# EAGLE design Impedance analyzer (EAGLE 8.7.1)
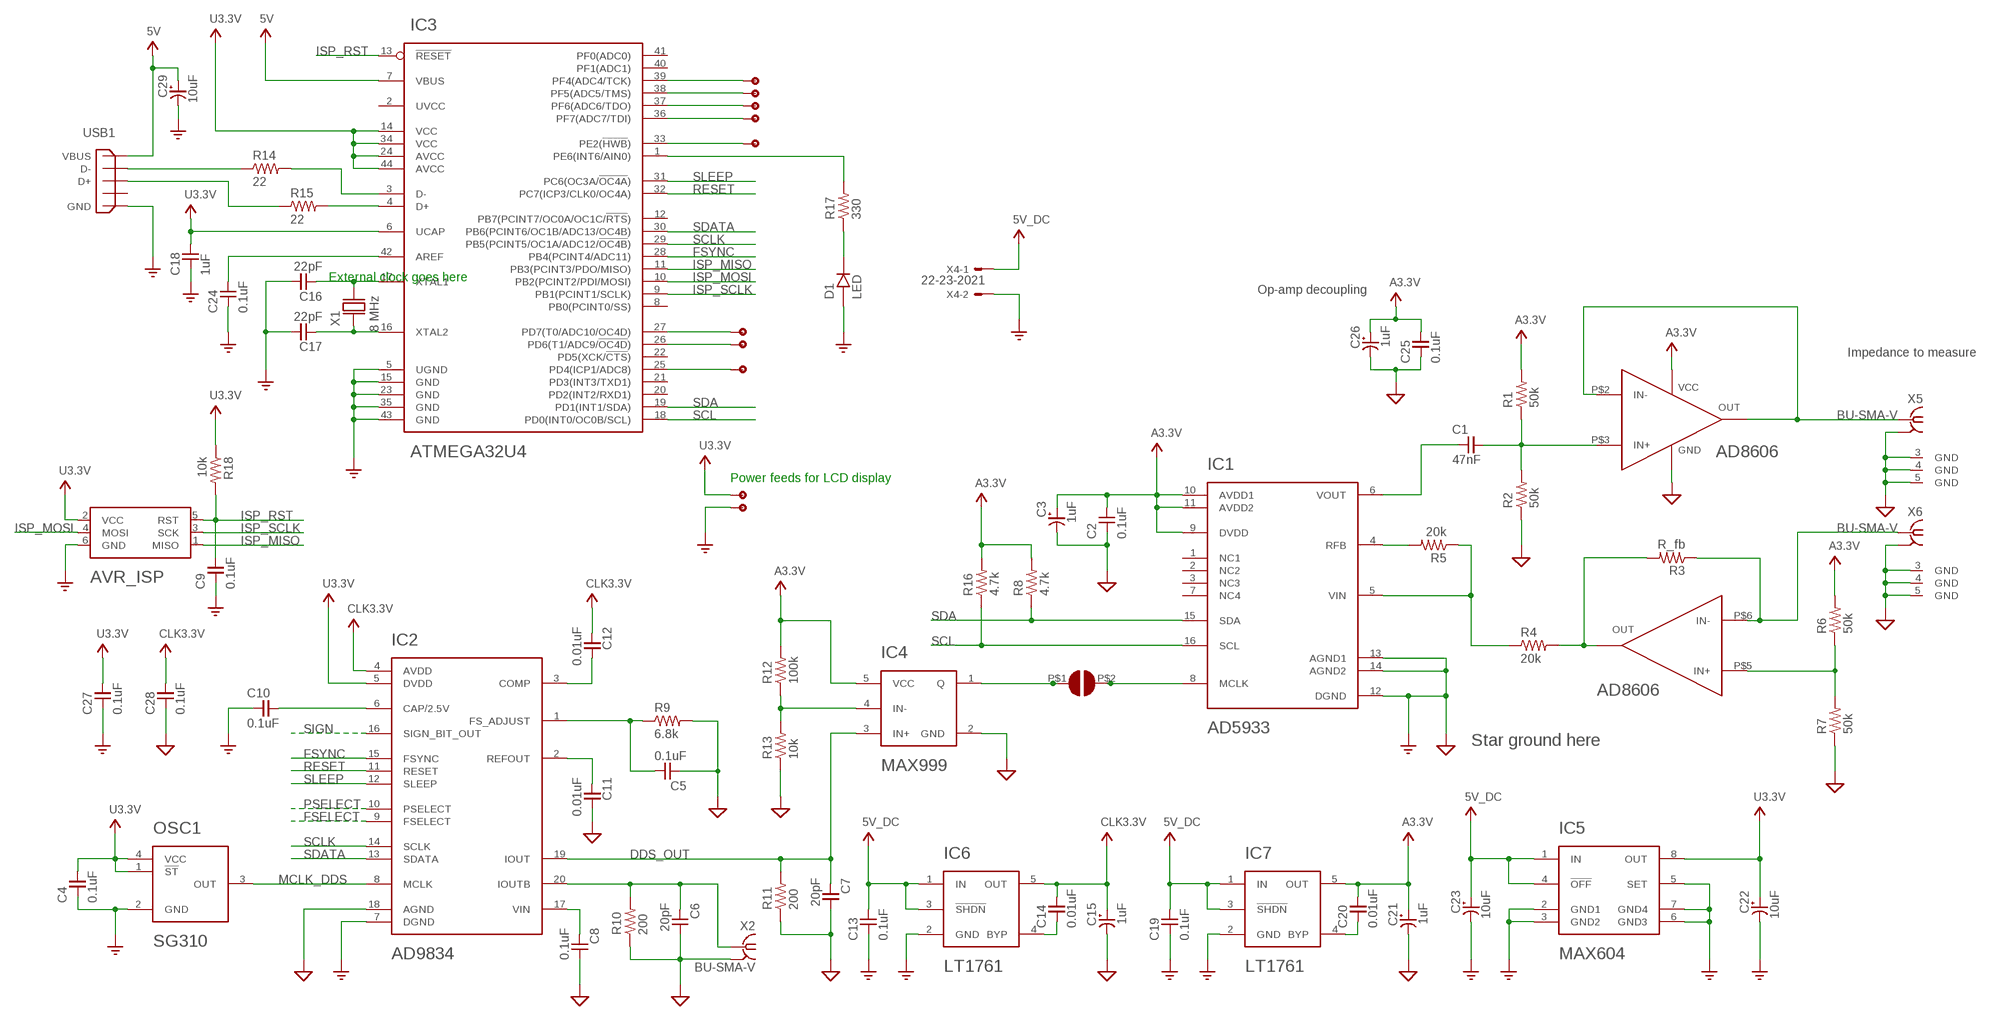
[diagram p0: schematic, sheet 1]

## Parts
C1  47nF  CAPACITOR0805  [0805]
C2  0.1uF  CAPACITOR0805  [0805]
C3  1uF  CAPACITOR+  [1206]
C4  0.1uF  CAPACITOR0805  [0805]
C5  0.1uF  CAPACITOR0805  [0805]
C6  20pF  CAPACITOR0805  [0805]
C7  20pF  CAPACITOR0805  [0805]
C8  0.1uF  CAPACITOR0805  [0805]
C9  0.1uF  CAPACITOR0805  [0805]
C10  0.1uF  CAPACITOR0805  [0805]
C11  0.01uF  CAPACITOR0805  [0805]
C12  0.01uF  CAPACITOR0805  [0805]
C13  0.1uF  CAPACITOR0805  [0805]
C14  0.01uF  CAPACITOR0805  [0805]
C15  1uF  CAPACITOR+  [1206]
C16  22pF  CAPACITOR0805  [0805]
C17  22pF  CAPACITOR0805  [0805]
C18  1uF  CAPACITOR0805  [0805]
C19  0.1uF  CAPACITOR0805  [0805]
C20  0.01uF  CAPACITOR0805  [0805]
C21  1uF  CAPACITOR+  [1206]
C22  10uF  CAPACITOR+  [1206]
C23  10uF  CAPACITOR+  [1206]
C24  0.1uF  CAPACITOR0805  [0805]
C25  0.1uF  CAPACITOR0805  [0805]
C26  1uF  CAPACITOR+  [1206]
C27  0.1uF  CAPACITOR0805  [0805]
C28  0.1uF  CAPACITOR0805  [0805]
C29  10uF  CAPACITOR+  [1206]
D1  LED  DIODE0805  [0805]
IC1  AD5933  [SSOP_16]
IC2  AD9834  [TSSOP_20]
IC3  ATMEGA32U4  [TQFP_44]
IC4  MAX999  [SOT_23-5]
IC5  MAX604  MAX603  [SO_8]
IC6  LT1761  [TSOT-23]
IC7  LT1761  [TSOT-23]
IC8  AD8606  [MSOP_8]
OSC1  SG310  [SG310]
R1  50k  RESISTORSMD0805  [0805]
R2  50k  RESISTORSMD0805  [0805]
R3  R_fb  RESISTORSMD0805  [0805]
R4  20k  RESISTORSMD0805  [0805]
R5  20k  RESISTORSMD0805  [0805]
R6  50k  RESISTORSMD0805  [0805]
R7  50k  RESISTORSMD0805  [0805]
R8  4.7k  RESISTORSMD0805  [0805]
R9  6.8k  RESISTORSMD0805  [0805]
R10  200  RESISTORSMD0805  [0805]
R11  200  RESISTORSMD0805  [0805]
R12  100k  RESISTORSMD0805  [0805]
R13  10k  RESISTORSMD0805  [0805]
R14  22  RESISTORSMD0805  [0805]
R15  22  RESISTORSMD0805  [0805]
R16  4.7k  RESISTORSMD0805  [0805]
R17  330  RESISTORSMD0805  [0805]
R18  10k  RESISTORSMD0805  [0805]
TP1  TPSMALL  [TP_SMALL]
TP2  TPSMALL  [TP_SMALL]
TP3  TPSMALL  [TP_SMALL]
TP4  TPSMALL  [TP_SMALL]
TP5  TPSMALL  [TP_SMALL]
TP6  TPSMALL  [TP_SMALL]
TP7  TPSMALL  [TP_SMALL]
TP10  TPSMALL  [TP_SMALL]
TP11  TPSMALL  [TP_SMALL]
TP12  TPSMALL  [TP_SMALL]
U$41  ISP_HEADER  [ISP_HEADER]
U$57  JUMPER  [JUMPER]
USB1  USB_MINIUX60-MB-5ST  [USB_MINI]
X1  8 MHz  CRYSTALNX5032  [NX5032]
X2  BU-SMA-V  [BU-SMA-V]
X4  22-23-2021  [22-23-2021]
X5  BU-SMA-V  [BU-SMA-V]
X6  BU-SMA-V  [BU-SMA-V]

## Nets
5V_DC: C13.2 C19.2 C23.1 IC5.1(IN) IC5.4(!OFF) IC6.1(IN) IC6.3(!SHDN) IC7.1(IN) IC7.3(!SHDN) X4.1
5V_USB: C29.1 IC3.7(VBUS) USB1.1(VBUS) ; supply symbol labelled 5V
A3V3: C2.2 C3.1 C20.2 C21.1 C25.2 C26.1 IC1.9(DVDD) IC1.10(AVDD1) IC1.11(AVDD2) IC4.5(VCC) IC7.5(OUT) IC8.P$8(VCC) R1.2 R6.2 R8.2 R12.2 R16.2 ; supply symbol labelled A3.3V
CLK3V3: C12.1 C14.2 C15.1 C28.2 IC2.4(AVDD) IC6.5(OUT) ; supply symbol labelled CLK3.3V
DDS_OUT: C7.1 IC2.19(IOUT) IC4.3(IN+) R11.2
FSELECT: IC2.9(FSELECT)
FSYNC: IC2.15(FSYNC) IC3.28(PB4(PCINT4/ADC11))
GND: C2.1 C3.2 C4.1 C5.1 C6.2 C7.2 C8.2 C9.1 C10.1 C11.2 C13.1 C15.2 C16.2 C17.2 C18.1 C19.1 C21.2 C22.2 C23.2 C24.1 C25.1 C26.2 C27.1 C28.1 C29.2 D1.1(A) IC1.12(DGND) IC1.13(AGND1) IC1.14(AGND2) IC2.7(DGND) IC2.18(AGND) IC3.5(UGND) IC3.15(GND) IC3.23(GND) IC3.35(GND) IC3.43(GND) IC4.2(GND) IC5.2(GND1) IC5.3(GND2) IC5.5(SET) IC5.6(GND3) IC5.7(GND4) IC6.2(GND) IC7.2(GND) IC8.P$4(GND) OSC1.2(GND) R2.1 R7.1 R9.2 R10.1 R11.1 R13.1 TP11.TP_SMALL U$41.6(GND) USB1.5(GND) X2.2(GND) X4.2 X5.2(GND) X5.3(GND) X5.4(GND) X5.5(GND) X6.2(GND) X6.3(GND) X6.4(GND) X6.5(GND) ; supply symbol labelled AGND
ISP_MISO: IC3.11(PB3(PCINT3/PDO/MISO)) U$41.1(MISO)
ISP_MOSI: IC3.10(PB2(PCINT2/PDI/MOSI)) U$41.4(MOSI)
ISP_RST: C9.2 IC3.13(!RESET!) R18.2 U$41.5(RST)
ISP_SCLK: IC3.9(PB1(PCINT1/SCLK)) U$41.3(SCK)
MCLK_DDS: IC2.8(MCLK) OSC1.3(OUT)
N$1: C1.2 IC8.P$3(IN+) R1.1 R2.2
N$2: IC8.P$1(OUT) IC8.P$2(IN-) X5.1
N$3: IC8.P$6(IN-) R3.1 X6.1
N$4: IC8.P$7(OUT) R3.2 R4.2
N$5: IC8.P$5(IN+) R6.1 R7.2
N$6: IC1.4(RFB) R5.2
N$7: IC1.5(VIN) R4.1 R5.1
N$8: C1.1 IC1.6(VOUT)
N$9: IC3.1(PE6(INT6/AIN0)) R17.2
N$10: C24.2 IC3.42(AREF)
N$11: C5.2 IC2.1(FS_ADJUST) R9.1
N$12: C6.1 IC2.20(IOUTB) R10.2 X2.1
N$13: C10.2 IC2.6(CAP/2.5V)
N$14: C11.1 IC2.2(REFOUT)
N$15: D1.2(K) R17.1
N$16: C8.1 IC2.17(VIN)
N$17: C12.2 IC2.3(COMP)
N$18: IC3.27(PD7(T0/ADC10/OC4D)) TP1.TP_SMALL
N$19: C14.1 IC6.4(BYP)
N$20: IC3.26(PD6(T1/ADC9/!OC4D!)) TP2.TP_SMALL
N$21: IC3.39(PF4(ADC4/TCK)) TP3.TP_SMALL
N$22: IC4.4(IN-) R12.1 R13.2
N$23: IC3.4(D+) R15.2
N$24: R15.1 USB1.3(D+)
N$25: R14.1 USB1.2(D-)
N$26: IC3.3(D-) R14.2
N$27: C16.1 IC3.17(XTAL1) X1.P$2
N$28: C17.1 IC3.16(XTAL2) X1.P$1
N$29: IC3.38(PF5(ADC5/TMS)) TP4.TP_SMALL
N$30: C20.1 IC7.4(BYP)
N$31: IC3.37(PF6(ADC6/TDO)) TP5.TP_SMALL
N$32: IC3.36(PF7(ADC7/TDI)) TP6.TP_SMALL
N$33: IC3.25(PD4(ICP1/ADC8)) TP7.TP_SMALL
N$36: IC4.1(Q) U$57.P$1
N$37: IC1.8(MCLK) U$57.P$2
N$38: IC3.33(PE2(!HWB!)) TP12.TP_SMALL
PSELECT: IC2.10(PSELECT)
RESET: IC2.11(RESET) IC3.32(PC7(ICP3/CLK0/OC4A))
SCL: IC1.16(SCL) IC3.18(PD0(INT0/OC0B/SCL)) R16.1
SCLK: IC2.14(SCLK) IC3.29(PB5(PCINT5/OC1A/ADC12/!OC4B!))
SDA: IC1.15(SDA) IC3.19(PD1(INT1/SDA)) R8.1
SDATA: IC2.13(SDATA) IC3.30(PB6(PCINT6/OC1B/ADC13/OC4B))
SIGN: IC2.16(SIGN_BIT_OUT)
SLEEP: IC2.12(SLEEP) IC3.31(PC6(OC3A/!OC4A!))
U3V3: C4.2 C18.2 C22.1 C27.2 IC2.5(DVDD) IC3.6(UCAP) IC3.14(VCC) IC3.24(AVCC) IC3.34(VCC) IC3.44(AVCC) IC5.8(OUT) OSC1.1(!ST) OSC1.4(VCC) R18.1 TP10.TP_SMALL U$41.2(VCC) ; supply symbol labelled U3.3V
Unconnected: IC1.1(NC1) IC1.2(NC2) IC1.3(NC3) IC1.7(NC4) IC3.2(UVCC) IC3.8(PB0(PCINT0/SS)) IC3.12(PB7(PCINT7/OC0A/OC1C/!RTS!)) IC3.20(PD2(INT2/RXD1)) IC3.21(PD3(INT3/TXD1)) IC3.22(PD5(XCK/!CTS!)) IC3.40(PF1(ADC1)) IC3.41(PF0(ADC0)) USB1.4(NC)

## Notes on the sheet
- External clock goes here
- Op-amp decoupling
- Impedance to measure
- Power feeds for LCD display
- Star ground here

## Power pins joined to a net without a drawn wire
GND: X2.3(GND) X2.4(GND) X2.5(GND)

## Library data of the parts
C1 C2 C4-C14 C16-C20 C24 C25 C27 C28 = thomas:CAPACITOR: This is a capacitor
C3 C15 C21-C23 C26 C29 = thomas:CAPACITOR+: This is a polarized capacitor
D1 = thomas:DIODE: This is a diode
IC1 = thomas:AD5933: The AD5933 is a complete integrated network analyzer from Analog Devices
IC2 = thomas:AD9834: The AD9834 is a 3.3v/5v 75MHz DDS from Analog Devices
IC3 = thomas:ATMEGA32U4: The ATmega32U4 is an 8-bit microcontroller from Atmel
IC4 = thomas:MAX999: The MAX999 is a 3.3v/5v ultra-high-speed (4.5ns) comparator
IC5 = thomas:MAX603: The MAX603 is a 3.3v/5v 500mA linear regulator from Maxim IC
IC6 IC7 = thomas:LT1761: The LT1761 is a LDO voltage regulator from Linear Technology
IC8 = thomas:AD8606: The AD8606 is a dual op-amp from Analog Devices.
OSC1 = thomas:SG310: Crystal oscillator
R1-R18 = thomas:RESISTOR: This is a resistor
TP1-TP7 TP10-TP12 = thomas:TP: A test point
U$41 = thomas:ISP_HEADER: This is a six-pin ISP header for the ATMega Microcontroller
U$57 = thomas:JUMPER: This is a solder jumper
USB1 = thomas:USB_MINI: MINI USB Connector Source: http://www.hirose.co.jp/cataloge_hp/e24000019.pdf
X1 = thomas:CRYSTAL: This is a quartz crystal
X2 X5 X6 = con-coax:BU-SMA-V: FEMALE SMA CONNECTOR Radiall distributor RS 112-3794; OC_FARNELL: unknown; OC_NEWARK: unknown
X4 = con-molex:22-23-2021: .100" (2.54mm) Center Header - 2 Pin; MF: MOLEX; MPN: 22-23-2021; OC_FARNELL: 1462926; OC_NEWARK: 25C3832

## Board
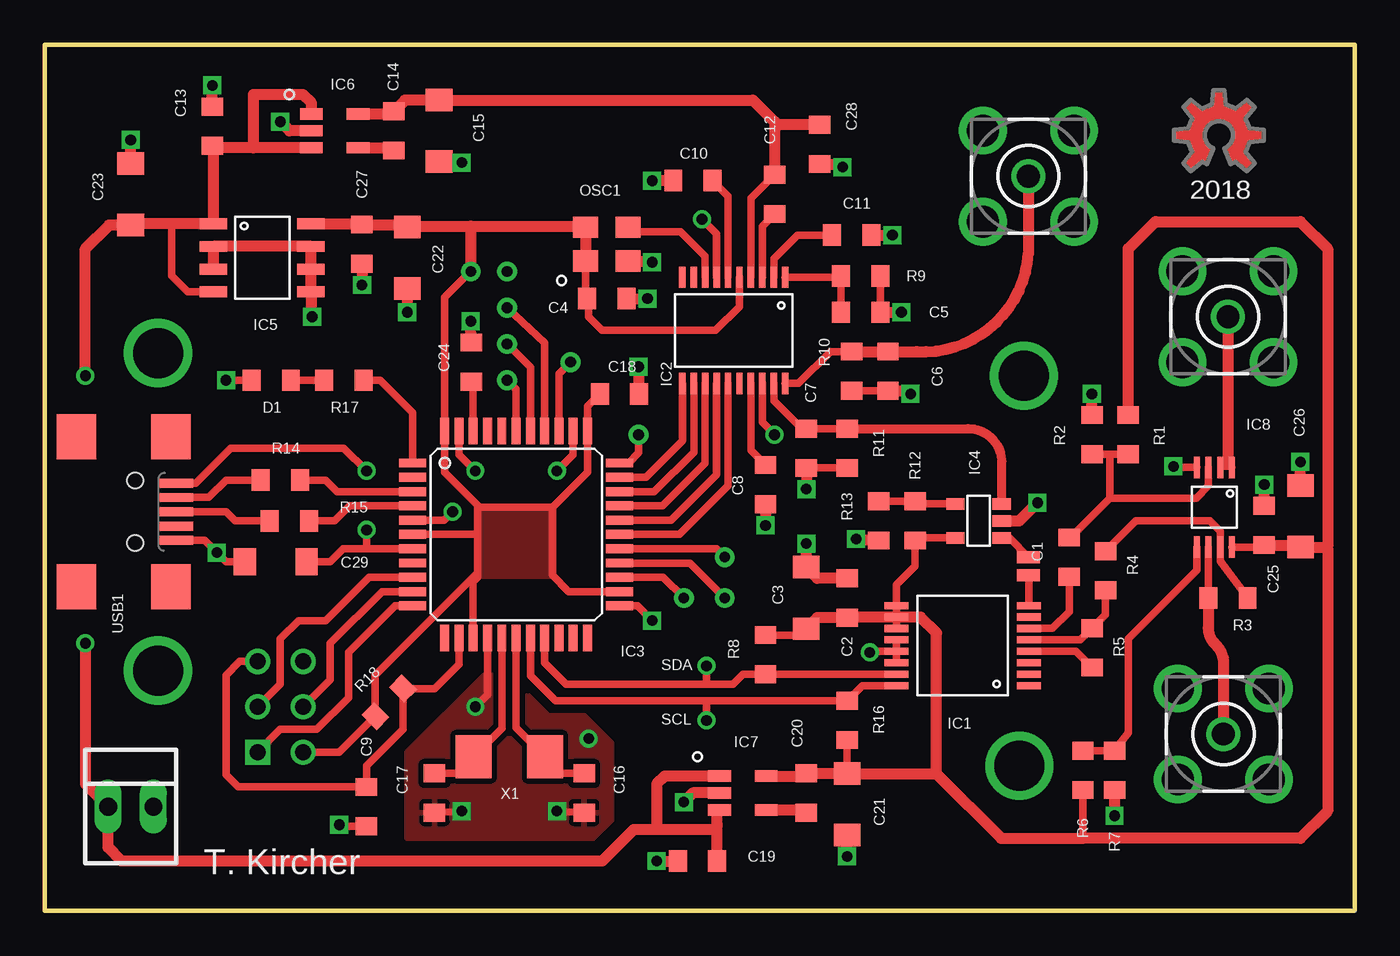
[diagram p1: board, top side]
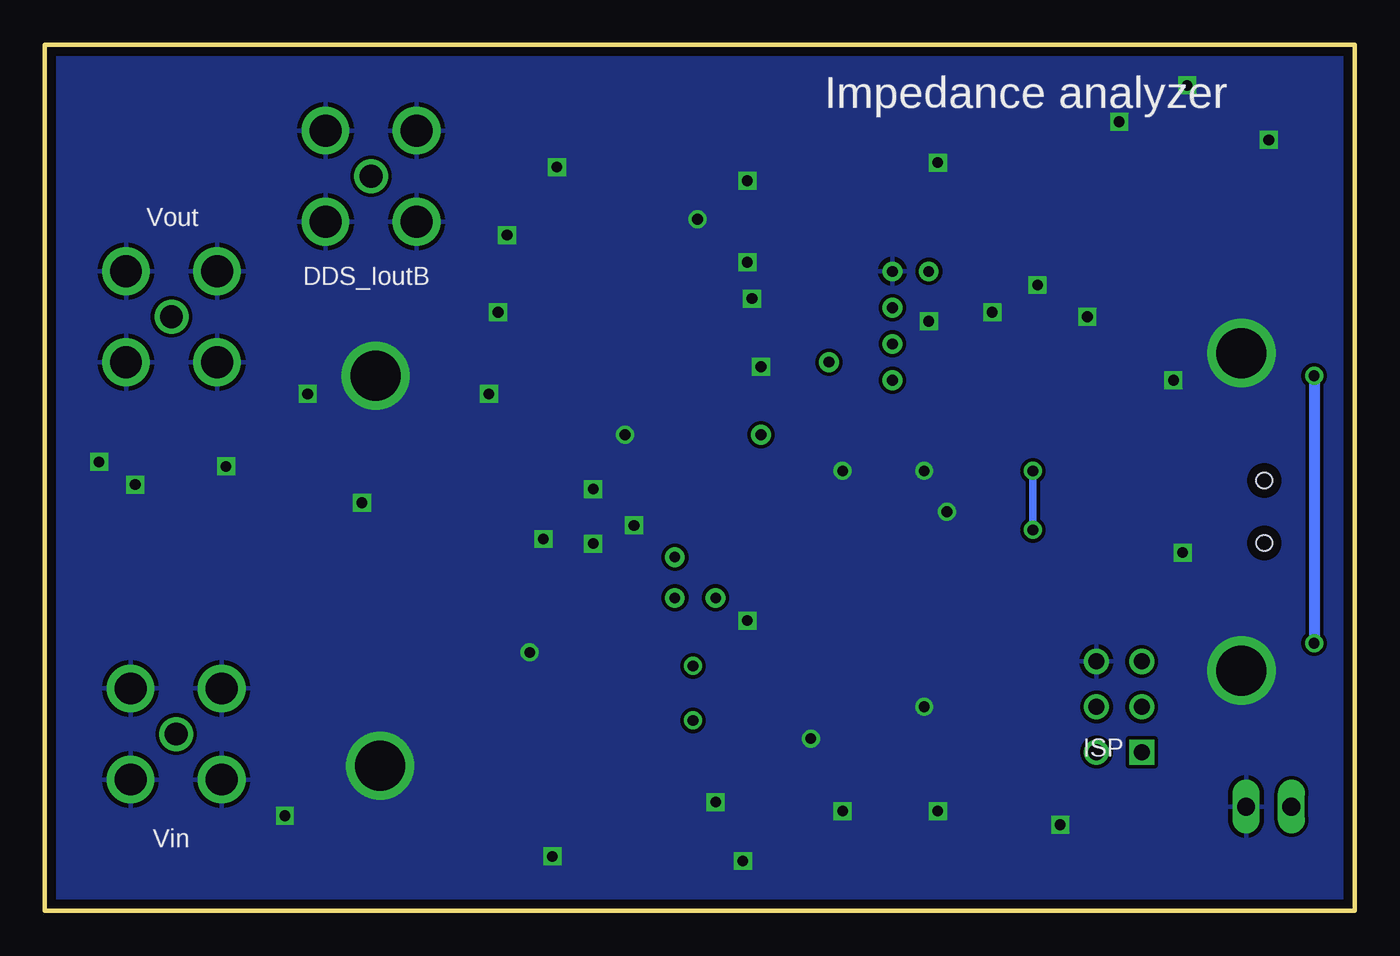
[diagram p2: board, bottom side, seen from below]

Size 73.41 x 48.51 mm. Coordinates in mm from the lower left corner, seen from the top.
Outline: 0,48.51 73.41,48.51 73.41,0 0,0 0,48.51
Copper layers (1*16): Top 0.035mm / dielectric 1.5mm / Bottom 0.035mm
Design rules "default *": minimum track width 10mil, minimum drill 24mil, track to track 8mil, track to pad 8mil, pad to pad 8mil, via to via 8mil, smd to smd 8mil, copper to edge 20mil, drill to drill 8mil, minimum pad ring 10mil, minimum via ring 8mil, stop-mask expansion 4mil, vias tented up to drill 0mil, thermal gap 10mil

### Footprints (pad centres in the part's own frame; a part is rotated, then mirrored left to right if it is on the bottom)
0805 = smd 1 x 1.2: 1 -1.1,0; 2 1.1,0
1206 = smd 1.25 x 1.5: 1 -1.725,0; 2 1.725,0
SSOP_16 = smd 0.4 x 1.341: 1 -2.24,-3.708; 2 -1.6,-3.708; 3 -0.96,-3.708; 4 -0.32,-3.708; 5 0.32,-3.708; 6 0.96,-3.708; 7 1.6,-3.708; 8 2.24,-3.708; 9 2.24,3.708; 10 1.6,3.708; 11 0.96,3.708; 12 0.32,3.708; 13 -0.32,3.708; 14 -0.96,3.708; 15 -1.6,3.708; 16 -2.24,3.708
TSSOP_20 = smd 0.356 x 1.194: 1 -2.88,-2.972; 2 -2.24,-2.972; 3 -1.6,-2.972; 4 -0.96,-2.972; 5 -0.32,-2.972; 6 0.32,-2.972; 7 0.96,-2.972; 8 1.6,-2.972; 9 2.24,-2.972; 10 2.88,-2.972; 11 2.88,2.972; 12 2.24,2.972; 13 1.6,2.972; 14 0.96,2.972; 15 0.32,2.972; 16 -0.32,2.972; 17 -0.96,2.972; 18 -1.6,2.972; 19 -2.24,2.972; 20 -2.88,2.972
TQFP_44 = smd 1.5 x 0.5: 1 -5.8,4; 2 -5.8,3.2; 3 -5.8,2.4; 4 -5.8,1.6; 5 -5.8,0.8; 6 -5.8,0; 7 -5.8,-0.8; 8 -5.8,-1.6; 9 -5.8,-2.4; 10 -5.8,-3.2; 11 -5.8,-4; 23 5.8,-4; 24 5.8,-3.2; 25 5.8,-2.4; 26 5.8,-1.6; 27 5.8,-0.8; 28 5.8,0; 29 5.8,0.8; 30 5.8,1.6; 31 5.8,2.4; 32 5.8,3.2; 33 5.8,4 | smd 0.5 x 1.5: 12 -4,-5.8; 13 -3.2,-5.8; 14 -2.4,-5.8; 15 -1.6,-5.8; 16 -0.8,-5.8; 17 0,-5.8; 18 0.8,-5.8; 19 1.6,-5.8; 20 2.4,-5.8; 21 3.2,-5.8; 22 4,-5.8; 34 4,5.8; 35 3.2,5.8; 36 2.4,5.8; 37 1.6,5.8; 38 0.8,5.8; 39 0,5.8; 40 -0.8,5.8; 41 -1.6,5.8; 42 -2.4,5.8; 43 -3.2,5.8; 44 -4,5.8
SOT_23-5 = smd 0.635 x 1.016: 1 -0.953,-1.295; 2 0,-1.295; 3 0.953,-1.295; 4 0.953,1.295; 5 -0.953,1.295
SO_8 = smd 1.524 x 0.61: 1 -2.731,1.905; 2 -2.731,0.635; 3 -2.731,-0.635; 4 -2.731,-1.905; 5 2.731,-1.905; 6 2.731,-0.635; 7 2.731,0.635; 8 2.731,1.905
TSOT-23 = smd 0.635 x 1.27: 1 -0.95,-1.31; 2 0,-1.31; 3 0.95,-1.31; 4 0.95,1.31; 5 -0.95,1.31
MSOP_8 = smd 0.34 x 1.19: P$1 -0.975,-2.23; P$2 -0.325,-2.23; P$3 0.325,-2.23; P$4 0.975,-2.23; P$5 0.975,2.23; P$6 0.325,2.23; P$7 -0.325,2.23; P$8 -0.975,2.23
SG310 = smd 1.4 x 1.2: 1 -1.2,-0.95; 2 1.2,-0.95; 3 1.2,0.95; 4 -1.2,0.95
TP_SMALL = drill 0.6: TP_SMALL 0,0
ISP_HEADER = drill 0.9 square: 1 -2.54,-1.27 | drill 0.9: 2 -2.54,1.27; 3 0,-1.27; 4 0,1.27; 5 2.54,-1.27; 6 2.54,1.27
JUMPER = smd 0.66 x 1.27: P$1 -0.508,0; P$2 0.508,0
USB_MINI = smd 2 x 0.5: 1 2.25,1.6; 2 2.25,0.8; 3 2.25,0; 4 2.25,-0.8; 5 2.25,-1.6 | smd 2.2 x 2.5: M1 -3.3,-4.2; M2 -3.3,4.2; M3 2,4.2; M4 2,-4.2 | hole 0.9: 0,-1.75; 0,1.75
NX5032 = smd 2 x 2.4: P$1 2,0; P$2 -2,0
BU-SMA-V = drill 1.27: 1 0,0 | drill 1.778: 2 -2.55,2.55; 3 2.55,2.55; 4 2.55,-2.55; 5 -2.55,-2.55
22-23-2021 = drill 1 long: 1 -1.27,0; 2 1.27,0

### Placement (x,y rotation side)
C1  57.4,19.81 90 top
C2  44.96,17.53 270 top
C3  42.67,17.53 90 top
C4  31.5,34.29 180 top
C5  45.72,33.53 180 top
C6  47.24,30.23 270 top
C7  42.67,25.91 270 top
C8  40.39,23.88 270 top
C9  18.03,5.84 90 top
C10  36.32,40.89 0 top
C11  45.21,37.85 0 top
C12  40.89,40.13 270 top
C13  9.4,43.94 270 top
C14  19.56,43.69 90 top
C15  22.1,43.69 270 top
C16  30.23,6.6 270 top
C17  21.84,6.6 270 top
C18  32.21,28.96 180 top
C19  36.58,2.79 0 top
C20  42.67,6.6 90 top
C21  44.96,5.97 270 top
C22  20.32,36.58 270 top
C23  4.83,40.13 90 top
C24  23.9,30.73 270 top
C25  68.33,21.59 270 top
C26  70.36,22.1 90 top
C27  17.78,37.34 90 top
C28  43.43,42.93 90 top
C29  12.95,19.56 180 top
D1  12.7,29.72 0 top
IC1  51.44,14.86 90 top
IC2  38.61,32.51 180 top
IC3  26.42,21.08 0 top
IC4  52.32,21.84 90 top
IC5  12.19,36.58 0 top
IC6  16.26,43.69 270 top
IC7  39.12,6.6 270 top
IC8  65.53,22.61 180 top
OSC1  31.5,37.34 0 top
R1  60.71,26.67 90 top
R2  58.67,26.67 270 top
R3  66.29,17.53 0 top
R4  59.44,19.05 90 top
R5  58.67,14.73 270 top
R6  58.17,7.87 270 top
R7  59.94,7.87 90 top
R8  40.39,14.35 90 top
R9  45.72,35.56 0 top
R10  45.21,30.23 90 top
R11  44.96,25.91 90 top
R12  48.77,21.84 270 top
R13  46.74,21.84 90 top
R14  13.21,24.13 0 top
R15  13.72,21.84 0 top
R16  44.96,10.67 270 top
R17  16.76,29.72 0 top
R18  19.3,11.68 45 top
TP1  38.1,19.81 0 top
TP2  38.1,17.53 0 top
TP3  25.91,29.72 0 top
TP4  25.91,31.75 0 top
TP5  25.91,33.78 0 top
TP6  29.46,30.73 0 top
TP7  35.81,17.53 0 top
TP10  23.88,35.81 0 top
TP11  25.91,35.81 0 top
TP12  33.27,26.67 0 top
U$1  [OSHWLOGO_TOP_0.2]  65.79,43.43 0 top
U$41  13.21,11.43 90 bottom
U$57  55.12,19.3 270 top
USB1  5.08,22.35 0 top
X1  26.04,8.64 180 top
X2  55.12,41.15 0 top
X4  4.83,5.84 0 top
X5  66.29,33.27 0 top
X6  66.04,9.91 0 top

### Tracks (layer width: path | path; a pad name or v marks a point on that pad's centre or on a via)
5V_DC  (via drill 0.6)
  Top 0.406: 9.5,42.74 9.44,42.67 | 37.68,5.52 IC7.3 | 37.68,4.83 37.59,4.57 37.68,4.74 | IC5.4 8,34.67 7.11,35.56 7.11,38.48
  Top 0.61: IC6.3 11.68,42.74 | 11.68,42.74 9.5,42.74 | IC6.1 14.95,45.25 14.48,45.72 11.68,45.72 11.68,42.74 | C13.2 9.4,42.71 9.44,42.67 9.44,38.51 IC5.1 7.11,38.48 4.9,38.48 C23.1 3.61,38.41 2.29,37.08 v2.29,29.97 | 37.68,4.83 37.68,5.52 | IC7.1 34.73,7.55 34.29,7.11 34.29,4.57 | 34.29,4.57 37.59,4.57 | C19.2 37.68,4.74 | 34.29,4.57 33.02,4.57 31.24,2.79 4.32,2.79 3.56,3.56 X4.1 2.29,7.11 v2.29,14.99
  Bottom 0.61: v2.29,29.97 v2.29,14.99
5V_USB  (via drill 0.6)
  Top 0.406: USB1.1 8.46,23.95 10.41,25.91 16.76,25.91 v18.03,24.64 | C29.1 16,19.56 16.73,20.28 18.07,20.28 | v18.03,21.34 18.03,20.32 18.07,20.28 | IC3.7 18.07,20.28
  Bottom 0.406: v18.03,24.64 v18.03,21.34
A3V3
  Top 0.406: IC8.P$8 67.7,20.38 C25.2 | IC1.11 IC1.10 IC1.9 47.73,18.26 48.77,19.3 R12.2 48.66,20.89 IC4.5 | 42.52,7.55 C20.2 | 45.3,16.34 C2.2 | R6.2 58.17,4.06 | 71.88,20.43 71.83,20.37 | R16.2 C21.1 | R8.2 42.32,15.45 C3.1
  Top 0.61: C25.2 70.24,20.49 C26.1 71.83,20.37 71.88,20.32 71.88,5.59 70.36,4.06 58.17,4.06 53.59,4.06 49.96,7.69 | IC7.5 42.52,7.55 | C20.2 44.69,7.7 C21.1 49.96,7.69 | R1.2 60.71,37.08 62.23,38.61 70.36,38.61 71.88,37.08 71.88,20.43 | 49.96,7.69 49.96,15.57 49.07,16.46 IC1.10 45.25,16.46 C2.2 43.3,16.43 C3.1
CLK3V3
  Top 0.406: IC2.4 39.57,39.91 C12.1
  Top 0.61: 40.89,43.69 40.89,44.2 39.68,45.41 C15.1 20.18,45.41 C14.2 19.41,44.64 IC6.5 | 40.89,43.69 C12.1 | C28.2 40.98,44.03 40.89,43.69
DDS_OUT
  Top 0.406: R11.2 C7.1 42.42,27.01 40.85,28.58 IC2.19
  Top 0.508: R11.2 51.73,27.01 arc-90 53.62,25.12 IC4.3
FSYNC
  Top 0.406: IC3.28 35.56,21.08 38.29,23.81 IC2.15
GND  (via drill 0.6, 2.8)
  Top 0.406: USB1.5 8.97,20.75 v9.65,20.07 10.16,19.56 C29.2 | IC3.5 22.39,21.88 v22.86,22.35 | IC3.43 23.22,25.55 v24.13,24.64 | IC3.23 33.21,17.08 v34.04,16.26 | IC3.35 29.62,25.55 v28.7,24.64 | R11.1 C7.2 | R9.2 C5.1 | R10.1 C6.2 | IC2.18 40.21,27.36 v40.89,26.67 | IC1.13 IC1.14 | IC1.13 46.42,14.54 v46.23,14.48 | IC1.12 IC1.13 | IC8.P$4 63.3,24.84 v63.25,24.89 | D1.1 v10.16,29.72 | IC3.15 24.82,12.12 v24.13,11.43 | IC2.7 37.65,37.92 v36.83,38.73 | v23.37,5.59 C17.2 | C16.2 v28.7,5.59 | C9.1 16.68,4.74 v16.51,4.83
  Top 0.61: IC5.3 IC5.2 IC5.7 IC5.6 IC5.5 14.92,33.34 v14.99,33.27 | C22.2 v20.32,33.53 | C27.1 v17.78,35.05 | IC6.2 13.72,43.69 v13.21,44.2 | 33.31,28.73 C18.1 33.27,29.5 v33.27,30.48 | C23.2 v4.83,43.18 | C13.1 v9.4,46.23 | C24.1 v23.88,33.02 | IC7.2 36.32,6.6 v35.81,6.1 | C25.1 v68.33,23.88 | IC4.2 54.61,21.84 v55.63,22.86 | C7.2 v42.67,23.62 | C5.1 v48.01,33.53 | C8.2 v40.39,21.59 | C11.2 v47.5,37.85 | C15.2 23.32,41.96 v23.37,41.91 | C28.1 44.37,41.83 v44.7,41.66 | v44.96,3.05 C21.2 | R7.1 v59.94,5.33 | R2.1 v58.67,28.96 | C2.1 43.3,18.63 C3.2 v42.67,20.57 | v34.29,2.79 C19.1 | C6.2 48.34,29.13 v48.51,28.96 | R13.1 45.64,20.74 v45.47,20.83 | C26.2 v70.36,25.15 | C4.1 v33.78,34.29 | OSC1.2 33.97,36.39 v34.04,36.32 | C10.1 v34.04,40.89
  other vias: 6.35,13.46 6.35,31.24 54.86,29.97 54.61,8.13 30.48,9.65
  pour Bottom: 0,48.51 73.41,48.51 73.41,0 0,0
  pour Top (isolate 0.305): 25.91,13.21 24.64,13.21 20.32,8.89 20.32,4.06 30.73,4.06 31.75,5.08 31.75,9.4 30.23,10.92 28.19,10.92
ISP_MISO
  Top 0.406: IC3.11 19.62,17.08 17.02,14.48 17.02,11.94 15.24,10.16 13.21,10.16 U$41.1
ISP_MOSI
  Top 0.406: IC3.10 18.9,17.88 16,14.99 16,12.95 U$41.4
ISP_RST
  Top 0.406: U$41.5 10.92,13.97 10.16,13.21 10.16,7.62 10.84,6.94 C9.2 18.03,8.13 20.08,10.18 R18.2 20.1,12.45 21.84,12.45 23.22,13.82 IC3.13
ISP_SCLK
  Top 0.406: IC3.9 18.17,18.68 15.75,16.26 14.22,16.26 13.21,15.24 13.21,12.7 U$41.3
MCLK_DDS
  Top 0.406: IC2.8 37.01,36.65 35.63,38.03 32.7,38.03 OSC1.3
N$1
  Top 0.406: IC8.P$3 65.21,23.8 64.52,23.11 59.69,23.11 | 59.69,25.57 R2.2 | C1.2 57.49,20.91 59.69,23.11 | 59.69,23.11 59.69,25.57 | R1.1 59.69,25.57
N$2
  Top 0.305: IC8.P$1 IC8.P$2
  Top 0.406: 66.29,25.05 IC8.P$1
  Top 0.61: X5.1 66.29,25.05
N$3
  Top 0.406: IC8.P$6 R3.1
  Top 0.61: R3.1 65.19,15.83 arc45 65.53,14.99 arc-45 66.04,13.97 X6.1
N$4
  Top 0.406: R3.2 65.86,19.57 IC8.P$7 65.86,21.27 65.28,21.84 61.13,21.84 R4.2
N$5
  Top 0.406: 64.56,19.85 IC8.P$5 64.56,19.09 60.71,15.24 60.71,9.99 R7.2 R6.1
N$6
  Top 0.406: IC1.4 57.77,14.54 R5.2
N$7
  Top 0.406: IC1.5 58.02,15.18 R5.1 59.44,16.59 R4.1
N$8
  Top 0.406: IC1.6 56.46,15.82 57.4,16.76 C1.1
N$9
  Top 0.406: IC3.1 20.62,27.9 18.8,29.72 R17.2
N$10
  Top 0.406: IC3.42 24.02,29.16 C24.2
N$11
  Top 0.406: C5.2 R9.1 44.44,35.48 IC2.1
N$12
  Top 0.406: IC2.20 42.24,29.54 44.03,31.33 R10.2
  Top 0.61: X2.1 55.12,36.83 arc-90 48.85,31.33 C6.1 R10.2
N$13
  Top 0.406: IC2.6 38.29,40.03 C10.2
N$14
  Top 0.406: IC2.2 40.85,36.53 42.16,37.85 C11.1
N$15
  Top 0.406: R17.1 D1.2
N$16
  Top 0.406: IC2.17 39.57,25.79 C8.1
N$17
  Top 0.406: IC2.3 40.21,38.35 C12.2
N$18
  Top 0.406: IC3.27 37.63,20.28 TP1.TP_SMALL
N$19
  Top 0.406: 19.41,42.74 C14.1
  Top 0.61: IC6.4 19.41,42.74
N$20
  Top 0.406: IC3.26 36.14,19.48 TP2.TP_SMALL
N$21
  Top 0.406: IC3.39 26.42,29.21 TP3.TP_SMALL
N$22
  Top 0.406: IC4.4 48.66,22.8 | R12.1 R13.2
  Top 0.61: 48.66,22.8 48.66,22.84 R12.1
N$23
  Top 0.406: R15.2 16.26,21.84 17.09,22.68 IC3.4
N$24
  Top 0.406: USB1.3 10.16,22.35 10.67,21.84 R15.1
N$25
  Top 0.406: USB1.2 9.18,23.15 10.16,24.13 R14.1
N$26
  Top 0.406: IC3.3 16.4,23.48 15.75,24.13 R14.2
N$27
  Top 0.406: IC3.17 26.42,10.25 X1.P$2 27.43,8.29 28.45,7.7 C16.1
N$28
  Top 0.406: X1.P$1 24.64,8.29 | IC3.16 25.62,10.22 X1.P$1 | C17.1 23.1,7.7 X1.P$1
N$29
  Top 0.406: IC3.38 27.22,30.44 TP4.TP_SMALL
N$30
  Top 0.406: 42.52,5.65 C20.1
  Top 0.61: IC7.4 42.52,5.65
N$31
  Top 0.406: IC3.37 28.02,31.83 TP5.TP_SMALL
N$32
  Top 0.406: IC3.36 28.82,30.09 TP6.TP_SMALL
N$33
  Top 0.406: IC3.25 34.66,18.68 TP7.TP_SMALL
N$36
  Top 0.406: U$57.P$1 54.04,20.89 IC4.1
N$37
  Top 0.406: IC1.8 55.14,18.8 U$57.P$2
N$38
  Top 0.406: TP12.TP_SMALL 33.27,25.65 32.7,25.08 IC3.33
RESET
  Top 0.406: IC3.32 33.68,24.28 35.73,26.33 IC2.11
SCL  (via drill 0.6)
  Top 0.406: IC3.18 27.22,13.17 28.62,11.77 37.08,11.77 | IC1.16 45.81,12.62 R16.1 37.08,11.77 | v37.08,10.67 37.08,11.77
SCLK
  Top 0.406: IC3.29 35.09,21.88 37.65,24.44 IC2.14
SDA  (via drill 0.6)
  Top 0.406: IC3.19 28.02,13.89 29.21,12.7 37.08,12.7 | IC1.15 R8.1 39.12,13.25 38.56,12.7 37.08,12.7 | v37.08,13.72 37.08,12.7
SDATA
  Top 0.406: IC3.30 34.62,22.68 37.01,25.07 IC2.13
SLEEP
  Top 0.406: IC3.31 34.15,23.48 36.37,25.7 IC2.12
U3V3
  Top 0.406: IC3.24 29.36,17.88 28.45,18.8 28.45,22.61 | 24.27,22.72 22.42,24.57 IC3.44 22.42,34.35 TP10.TP_SMALL | 24.27,22.72 24.38,22.61 28.45,22.61 | 28.45,22.61 30.42,24.57 IC3.34 30.42,28.27 C18.2 | 24.27,21.08 24.27,22.72 | OSC1.1 30.3,34.64 C4.2 30.48,34.29 30.48,33.27 31.24,32.51 37.59,32.51 38.93,33.85 IC2.5 | IC3.6 24.27,21.08 | 30.23,38.35 OSC1.4 | 20.57,38.35 C22.1 | 24.27,18.94 24.27,18.68 24.02,18.43 IC3.14 | 24.27,18.94 24.27,21.08 | U$41.2 16.51,8.89 R18.1 18.53,13.19 24.27,18.94
  Top 0.61: OSC1.4 OSC1.1 | IC5.8 17.48,38.48 C27.2 20.18,38.44 C22.1 | 20.57,38.35 23.88,38.35 | 23.88,38.35 30.23,38.35 | 23.88,38.35 TP10.TP_SMALL
  pour Top: 24.26,22.61 28.45,22.61 28.45,18.8 24.26,18.8

### Text on the board
tNames: 2018 | SDA | SCL | T. Kircher
bNames: Impedance analyzer | Vout | DDS_IoutB | ISP | Vin